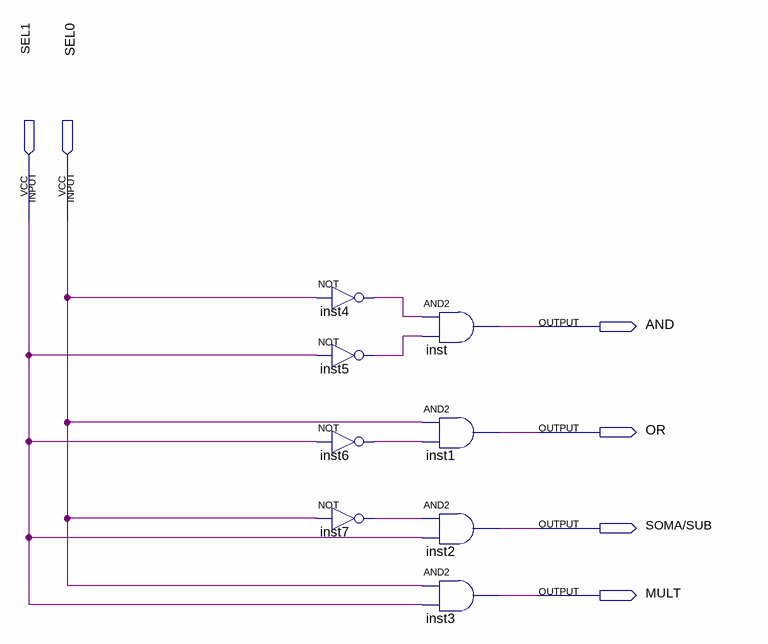
[diagram p0: schematic sheet]
// Quartus schematic MUX.bdf as structural Verilog: 8 symbols, 6 pins
module MUX (
  input  SEL1,
  input  SEL0,
  output AND,
  output OR,
  output \SOMA/SUB ,
  output MULT
);

  wire inst4_out, inst5_out, inst6_out, inst7_out;

  not inst4 (inst4_out, SEL0);
  not inst5 (inst5_out, SEL1);
  not inst6 (inst6_out, SEL1);
  not inst7 (inst7_out, SEL0);
  and inst (AND, inst4_out, inst5_out);
  and inst1 (OR, SEL0, inst6_out);
  and inst2 (\SOMA/SUB , inst7_out, SEL1);
  and inst3 (MULT, SEL0, SEL1);
endmodule
